# EAGLE design wizneteval (EAGLE 7.2.0)

## Sheet 1 of 2
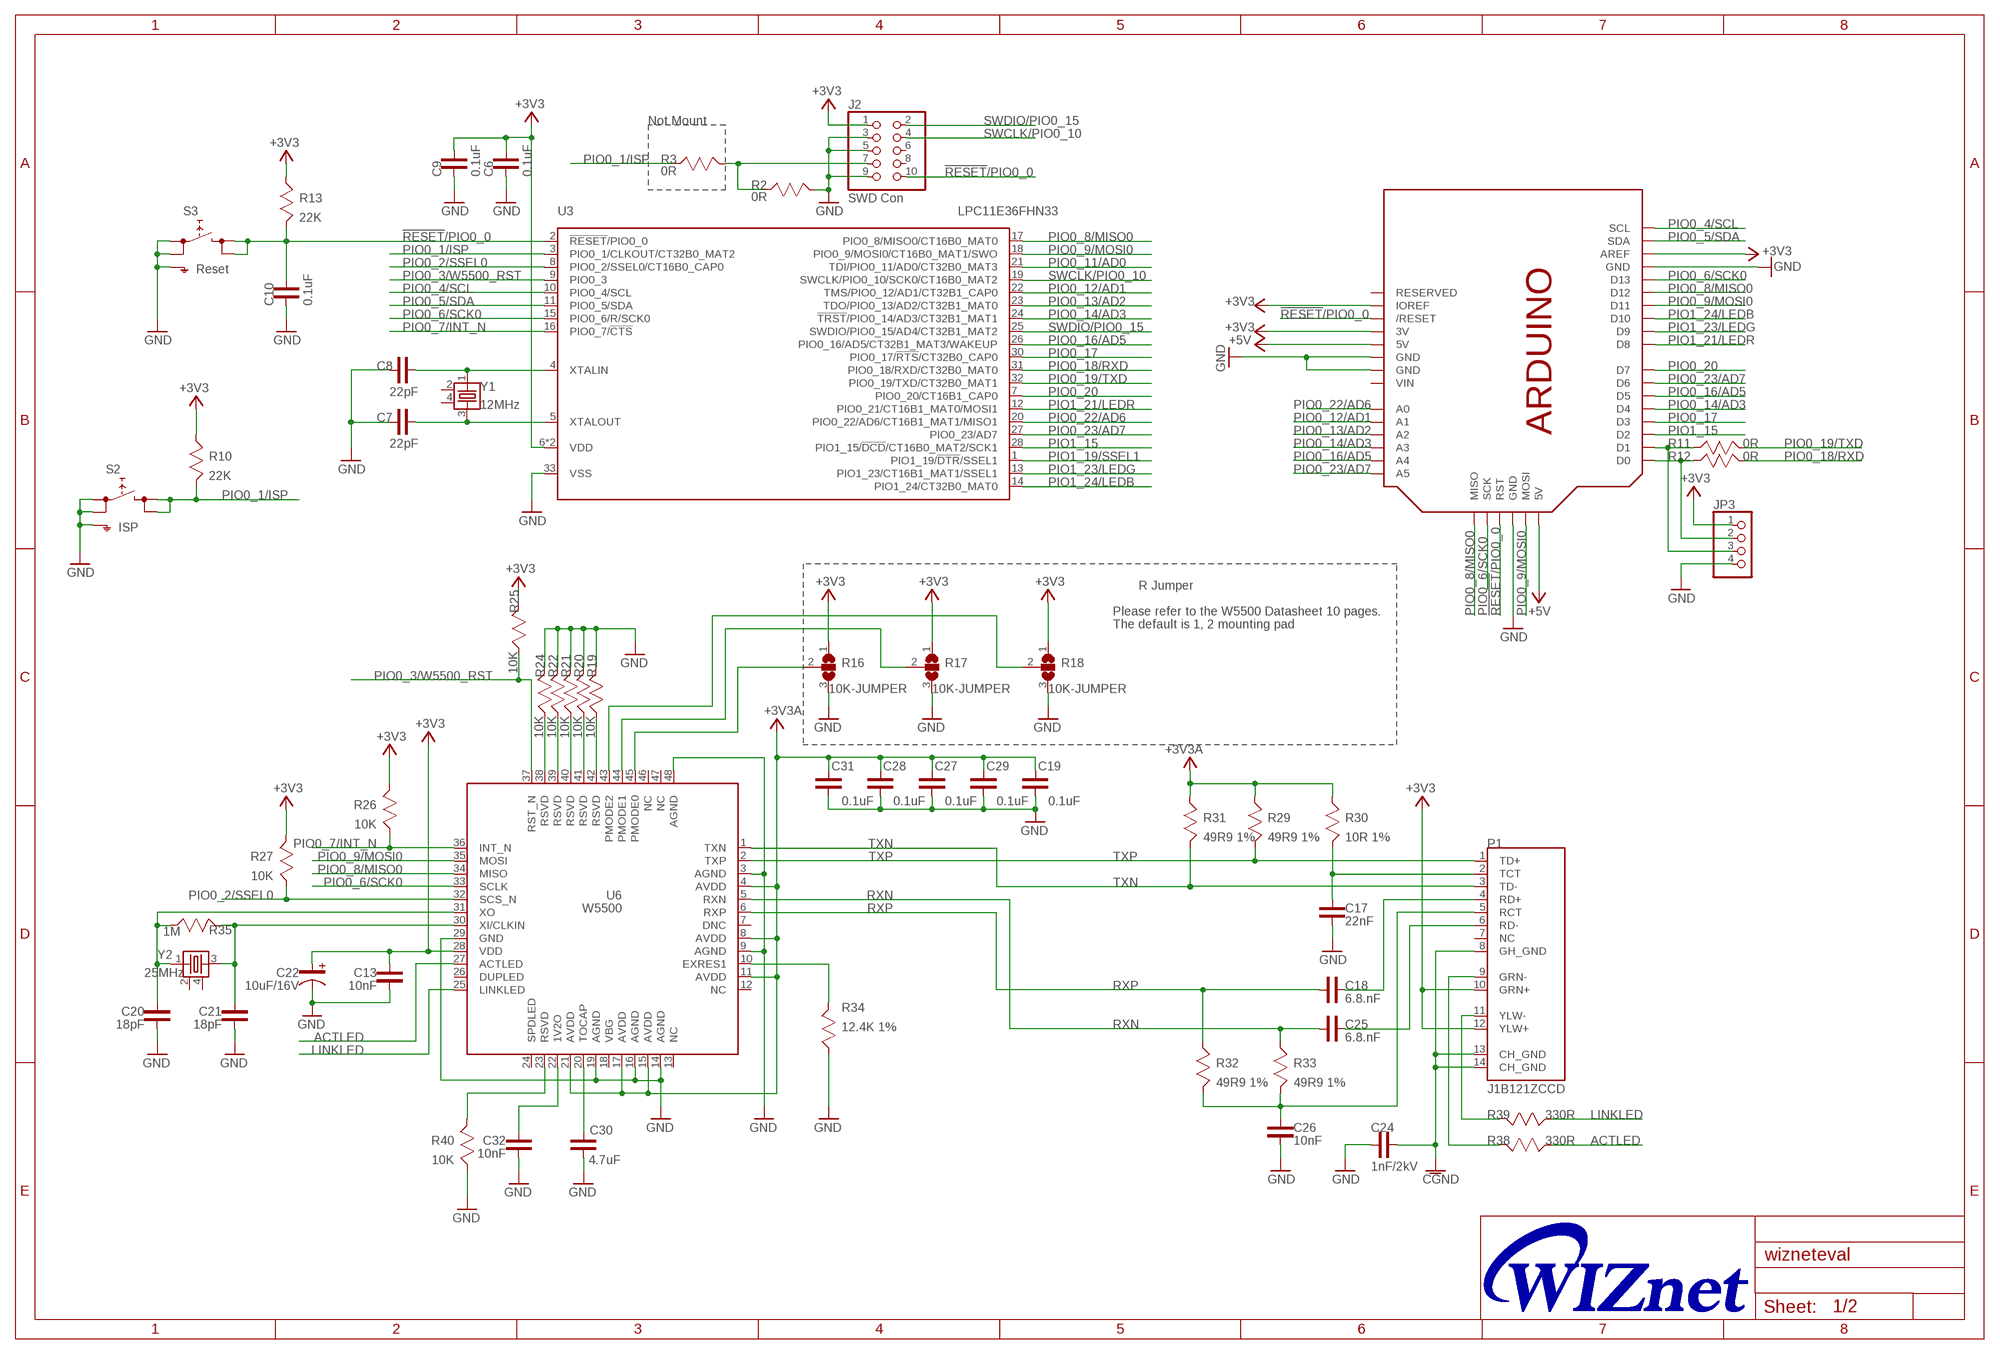
[diagram p0: schematic, sheet 1]

### Parts
$$U$3  ARDUINO_R3_ICSP  [ARDUINOR3_ICSP]
C6  0.1uF  C-1608  [C-1608]
C7  22pF  C-1608  [C-1608]
C8  22pF  C-1608  [C-1608]
C9  0.1uF  C-1608  [C-1608]
C10  0.1uF  C-1608  [C-1608]
C13  10nF  C-1608  [C-1608]
C17  22nF  C-1608  [C-1608]
C18  6.8.nF  C-1608  [C-1608]
C19  0.1uF  C-1608  [C-1608]
C20  18pF  C-1608  [C-1608]
C21  18pF  C-1608  [C-1608]
C22  10uF/16V  C-3216(TANTAL)  [C-3216(TANTAL)]
C24  1nF/2kV  C-4520  [C-4520]
C25  6.8.nF  C-1608  [C-1608]
C26  10nF  C-1608  [C-1608]
C27  0.1uF  C-1608  [C-1608]
C28  0.1uF  C-1608  [C-1608]
C29  0.1uF  C-1608  [C-1608]
C30  4.7uF  C-2012  [C-2012]
C31  0.1uF  C-1608  [C-1608]
C32  10nF  C-1608  [C-1608]
J2  SWD Con  2X5_1.27  [2X5_1.27]
JP3  PINHD-1X4  [1X04]
P1  J1B121ZCCD  [J1B121ZCCD]
R2  0R  R-1608  [R-1608]
R3  0R  R-1608  [R-1608]
R10  22K  R-1608  [R-1608]
R11  0R  R-1608  [R-1608]
R12  0R  R-1608  [R-1608]
R13  22K  R-1608  [R-1608]
R16  10K-JUMPER  R-1608-JUMPER  [R-1608-JUMPER]
R17  10K-JUMPER  R-1608-JUMPER  [R-1608-JUMPER]
R18  10K-JUMPER  R-1608-JUMPER  [R-1608-JUMPER]
R19  10K  R-1608  [R-1608]
R20  10K  R-1608  [R-1608]
R21  10K  R-1608  [R-1608]
R22  10K  R-1608  [R-1608]
R24  10K  R-1608  [R-1608]
R25  10K  R-1608  [R-1608]
R26  10K  R-1608  [R-1608]
R27  10K  R-1608  [R-1608]
R29  49R9 1%  R-1608  [R-1608]
R30  10R 1%  R-1608  [R-1608]
R31  49R9 1%  R-1608  [R-1608]
R32  49R9 1%  R-1608  [R-1608]
R33  49R9 1%  R-1608  [R-1608]
R34  12.4K 1%  R-1608  [R-1608]
R35  1M  R-1608  [R-1608]
R38  330R  R-1608  [R-1608]
R39  330R  R-1608  [R-1608]
R40  10K  R-1608  [R-1608]
S2  ISP  SKHMPSE010  [SKHMPXE010]
S3  Reset  SKHMPSE010  [SKHMPXE010]
U3  LPC11E36FHN33  [SOT-HVQFN33]
U6  W5500  [W5500]
Y1  12MHz  XTAL3225  [XTAL3225]
Y2  25MHz  XTAL3225  [XTAL3225]

### Nets
!RESET!/PIO0_0: $$U$3.RESET(/RESET) $$U$3.RESET_ICSP(RST) C10.2 J2.10 R13.1 S3.3(2.1) S3.4(2.2) U3.2(!RESET!/PIO0_0) ; also sheet 2
+3V3: $$U$3.3V $$U$3.AREF $$U$3.IOREF C6.2 C9.2 C13.2 C22.1 J2.1 JP3.1 P1.10(GRN+) P1.12(YLW+) R10.2 R13.2 R16.1 R17.1 R18.1 R25.2 R26.2 R27.2 U3.6(VDD) U3.29(VDD) U6.28(VDD) ; also sheet 2
+3V3A: C19.2 C27.2 C28.2 C29.2 C31.2 R29.2 R30.2 R31.2 U6.4(AVDD) U6.8(AVDD) U6.11(AVDD) U6.15(AVDD) U6.17(AVDD) U6.21(AVDD) ; also sheet 2
+5V: $$U$3.5V $$U$3.5V_ICSP(5V) ; also sheet 2
ACTLED: R38.2 U6.27(ACTLED)
GND: $$U$3.GND $$U$3.GND@1(GND) $$U$3.GND@2(GND) $$U$3.GND@3(GND) C6.1 C7.1 C8.1 C9.1 C10.1 C13.1 C17.1 C19.1 C20.1 C21.1 C22.2 C24.1 C26.1 C27.1 C28.1 C29.1 C30.P$1 C31.1 C32.1 J2.3 J2.5 J2.9 JP3.4 R2.1 R16.3 R17.3 R18.3 R19.2 R20.2 R21.2 R22.2 R24.2 R34.1 R40.1 S2.1(1.1) S2.2(1.2) S2.5(SH) S3.1(1.1) S3.2(1.2) S3.5(SH) U3.33(VSS) U6.3(AGND) U6.9(AGND) U6.14(AGND) U6.16(AGND) U6.19(AGND) U6.29(GND) U6.48(AGND) ; also sheet 2
GNDA: C24.2 P1.8(GH_GND) P1.13(CH_GND) P1.14(CH_GND) ; supply symbol labelled CGND
LINKLED: R39.2 U6.25(LINKLED)
N$1: C8.2 U3.4(XTALIN) Y1.1
N$2: C7.2 U3.5(XTALOUT) Y1.3
N$3: R34.2 U6.10(EXRES1)
N$4: C30.P$2 U6.20(TOCAP)
N$5: $$U$3.D1 JP3.3 R11.2
N$6: C32.2 U6.22(1V2O)
N$8: R40.2 U6.23(RSVD)
N$9: R19.1 U6.42(RSVD)
N$10: R20.1 U6.41(RSVD)
N$11: R21.1 U6.40(RSVD)
N$12: R22.1 U6.39(RSVD)
N$13: R24.1 U6.38(RSVD)
N$30: C18.1 P1.4(RD+)
N$31: C25.1 P1.6(RD-)
N$33: C17.2 P1.2(TCT) R30.1
N$34: P1.11(YLW-) R39.1
N$35: P1.9(GRN-) R38.1
N$36: C26.2 P1.5(RCT) R32.1 R33.1
N$37: $$U$3.D0 JP3.2 R12.2
N$57: J2.7 R2.2 R3.1
PIO0_1/ISP: R3.2 R10.1 S2.3(2.1) S2.4(2.2) U3.3(PIO0_1/CLKOUT/CT32B0_MAT2) ; also sheet 2
PIO0_2/SSEL0: R27.1 U3.8(PIO0_2/SSEL0/CT16B0_CAP0) U6.32(SCS_N) ; also sheet 2
PIO0_3/W5500_RST: R25.1 U3.9(PIO0_3) U6.37(RST_N) ; also sheet 2
PIO0_4/SCL: $$U$3.SCL U3.10(PIO0_4/SCL) ; also sheet 2
PIO0_5/SDA: $$U$3.SDA U3.11(PIO0_5/SDA) ; also sheet 2
PIO0_6/SCK0: $$U$3.D13 $$U$3.SCK U3.15(PIO0_6/R/SCK0) U6.33(SCLK) ; also sheet 2
PIO0_7/INT_N: R26.1 U3.16(PIO0_7/!CTS!) U6.36(INT_N) ; also sheet 2
PIO0_8/MISO0: $$U$3.D12 $$U$3.MISO U3.17(PIO0_8/MISO0/CT16B0_MAT0) U6.34(MISO) ; also sheet 2
PIO0_9/MOSI0: $$U$3.D11 $$U$3.MOSI U3.18(PIO0_9/MOSI0/CT16B0_MAT1/SWO) U6.35(MOSI) ; also sheet 2
PIO0_11/AD0: U3.21(TDI/PIO0_11/AD0/CT32B0_MAT3) ; also sheet 2
PIO0_12/AD1: $$U$3.A1 U3.22(TMS/PIO0_12/AD1/CT32B1_CAP0) ; also sheet 2
PIO0_13/AD2: $$U$3.A2 U3.23(TDO/PIO0_13/AD2/CT32B1_MAT0) ; also sheet 2
PIO0_14/AD3: $$U$3.A3 $$U$3.D4 U3.24(!TRST!/PIO0_14/AD3/CT32B1_MAT1) ; also sheet 2
PIO0_16/AD5: $$U$3.A4 $$U$3.D5 U3.26(PIO0_16/AD5/CT32B1_MAT3/WAKEUP) ; also sheet 2
PIO0_17: $$U$3.D3 U3.30(PIO0_17/!RTS!/CT32B0_CAP0) ; also sheet 2
PIO0_18/RXD: R12.1 U3.31(PIO0_18/RXD/CT32B0_MAT0) ; also sheet 2
PIO0_19/TXD: R11.1 U3.32(PIO0_19/TXD/CT32B0_MAT1) ; also sheet 2
PIO0_20: $$U$3.D7 U3.7(PIO0_20/CT16B1_CAP0) ; also sheet 2
PIO0_22/AD6: $$U$3.A0 U3.20(PIO0_22/AD6/CT16B1_MAT1/MISO1) ; also sheet 2
PIO0_23/AD7: $$U$3.A5 $$U$3.D6 U3.27(PIO0_23/AD7) ; also sheet 2
PIO1_15: $$U$3.D2 U3.28(PIO1_15/!DCD!/CT16B0_MAT2/SCK1) ; also sheet 2
PIO1_19/SSEL1: U3.1(PIO1_19/!DTR!/SSEL1) ; also sheet 2
PIO1_21/LEDR: $$U$3.D8 U3.12(PIO0_21/CT16B1_MAT0/MOSI1) ; also sheet 2
PIO1_23/LEDG: $$U$3.D9 U3.13(PIO1_23/CT16B1_MAT1/SSEL1) ; also sheet 2
PIO1_24/LEDB: $$U$3.D10 U3.14(PIO1_24/CT32B0_MAT0) ; also sheet 2
PMODE0: R16.2 U6.45(PMODE0)
PMODE1: R17.2 U6.44(PMODE1)
POMDE2: R18.2 U6.43(PMODE2)
RXN: C25.2 R33.2 U6.5(RXN)
RXP: C18.2 R32.2 U6.6(RXP)
SWCLK/PIO0_10: J2.4 U3.19(SWCLK/PIO0_10/SCK0/CT16B0_MAT2) ; also sheet 2
SWDIO/PIO0_15: J2.2 U3.25(SWDIO/PIO0_15/AD4/CT32B1_MAT2) ; also sheet 2
TXN: P1.3(TD-) R31.1 U6.1(TXN)
TXP: P1.1(TD+) R29.1 U6.2(TXP)
XI: C21.2 R35.2 U6.30(XI/CLKIN) Y2.3
XO: C20.2 R35.1 U6.31(XO) Y2.1
Unconnected: $$U$3.RESERVED J2.6 J2.8 P1.7(NC) U6.7(DNC) U6.12(NC) U6.13(NC) U6.18(VBG) U6.24(SPDLED) U6.26(DUPLED) U6.46(NC) U6.47(NC) Y1.2 Y1.4 Y2.2 Y2.4

### Notes on the sheet
- Not Mount
- R Jumper
- Please refer to the W5500 Datasheet 10 pages.
- The default is 1, 2 mounting pad

## Sheet 2 of 2
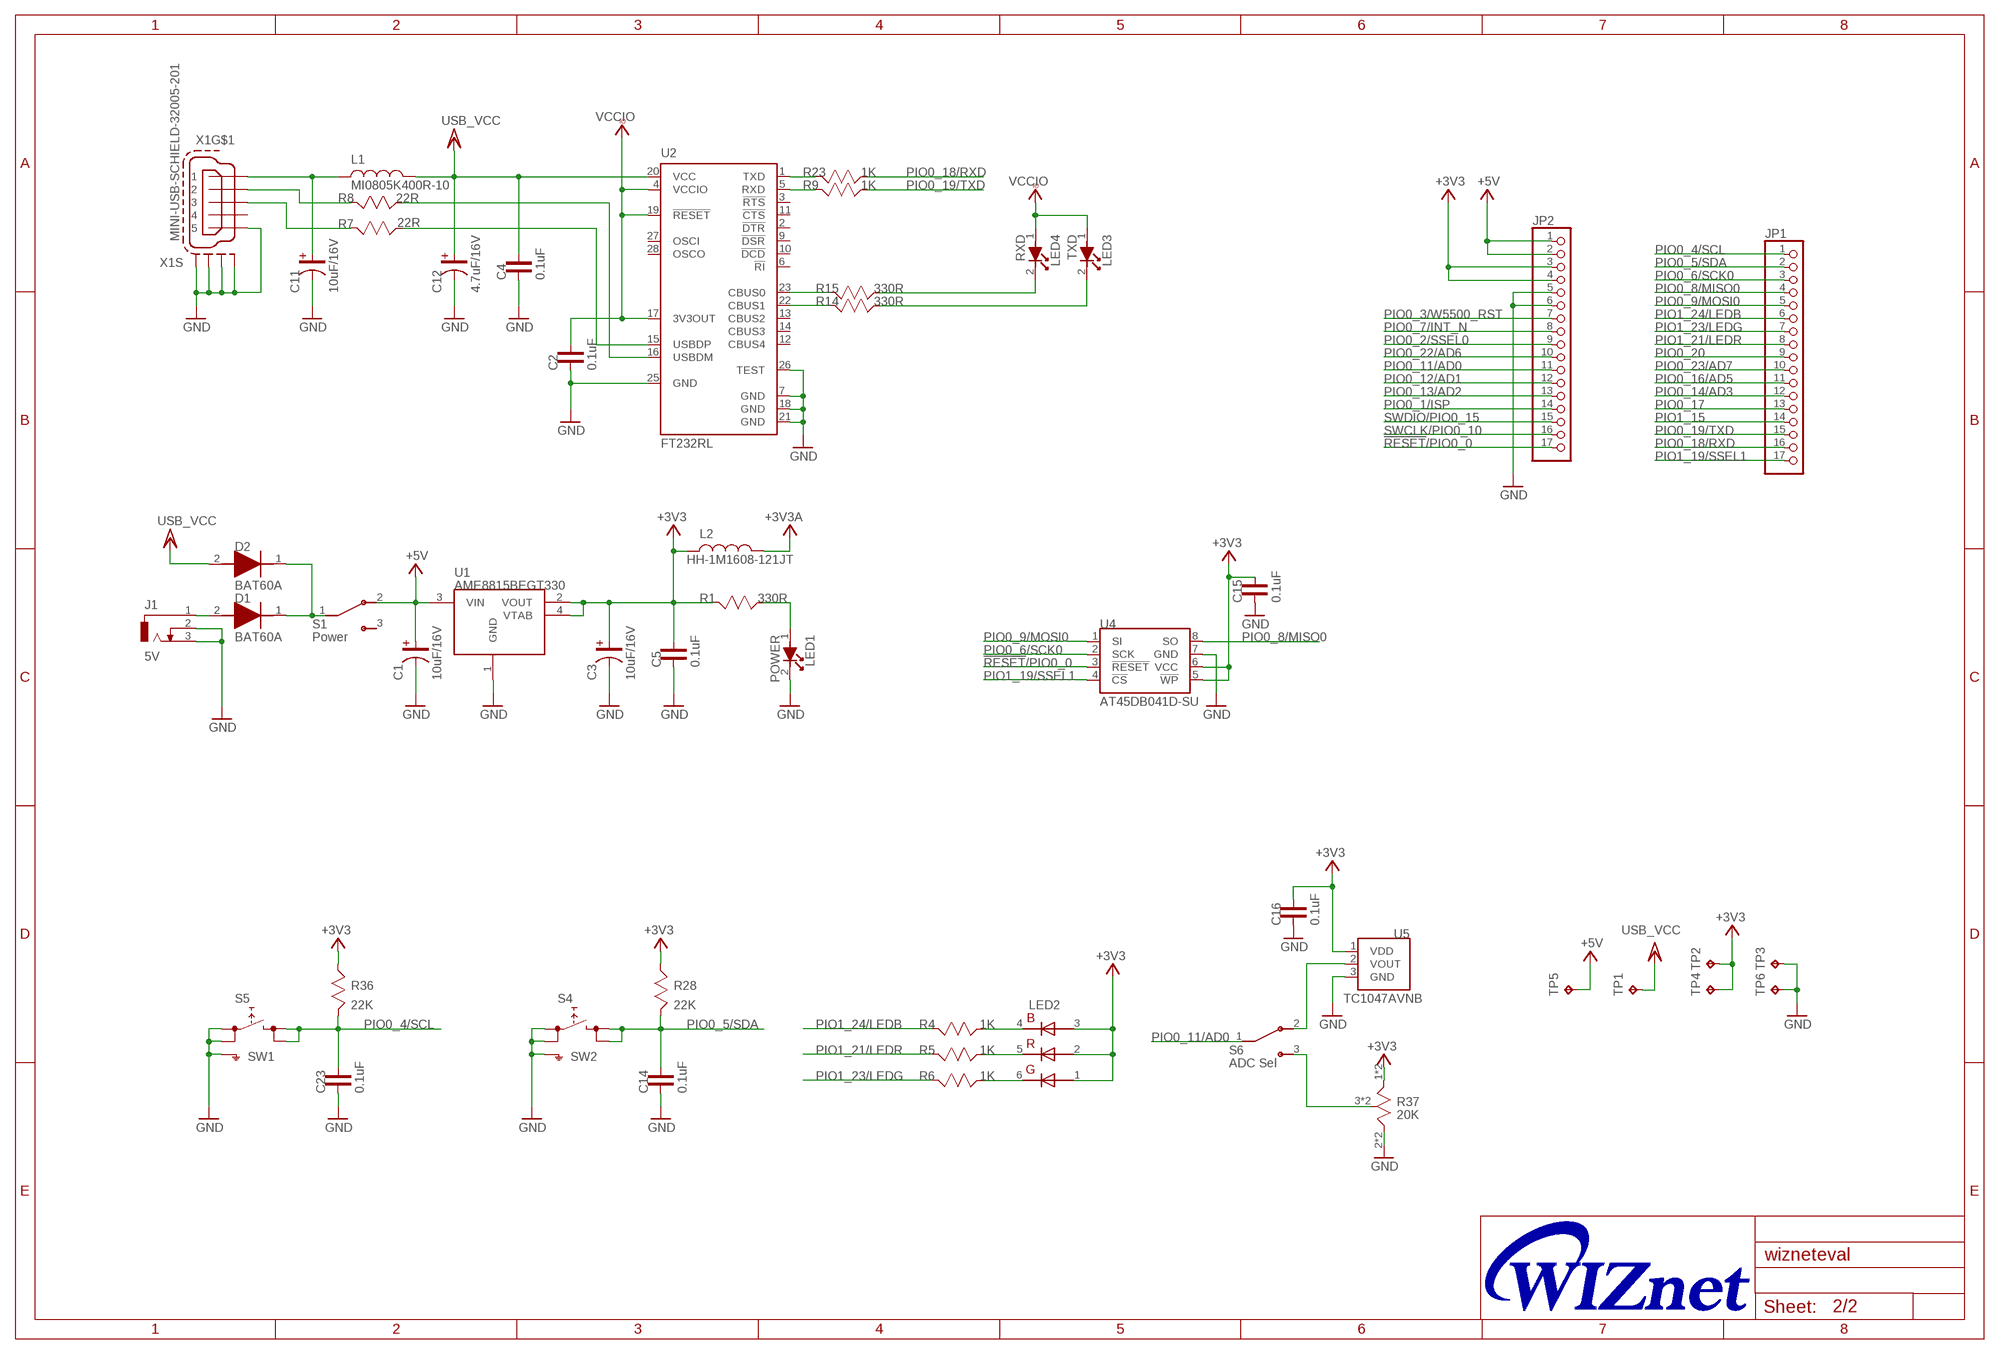
[diagram p1: schematic, sheet 2]

### Parts
C1  10uF/16V  C-3216(TANTAL)  [C-3216(TANTAL)]
C2  0.1uF  C-1608  [C-1608]
C3  10uF/16V  C-3216(TANTAL)  [C-3216(TANTAL)]
C4  0.1uF  C-1608  [C-1608]
C5  0.1uF  C-1608  [C-1608]
C11  10uF/16V  C-3216(TANTAL)  [C-3216(TANTAL)]
C12  4.7uF/16V  C-3216(TANTAL)  [C-3216(TANTAL)]
C14  0.1uF  C-1608  [C-1608]
C15  0.1uF  C-1608  [C-1608]
C16  0.1uF  C-1608  [C-1608]
C23  0.1uF  C-1608  [C-1608]
D1  BAT60A  [BAT60A]
D2  BAT60A  [BAT60A]
J1  5V  DCJ0202  [DCJ0202]
JP1  PINHD-1X17  [1X17]
JP2  PINHD-1X17  [1X17]
L1  MI0805K400R-10  L-2012  [L-2012]
L2  HH-1M1608-121JT  L-1608  [L-1608]
LED1  POWER  LED-1608  [LED-1608]
LED2  LS5050RGB5050  [LS5050RGB]
LED3  TXD  LED-1608  [LED-1608]
LED4  RXD  LED-1608  [LED-1608]
R1  330R  R-1608  [R-1608]
R4  1K  R-1608  [R-1608]
R5  1K  R-1608  [R-1608]
R6  1K  R-1608  [R-1608]
R7  22R  R-1608  [R-1608]
R8  22R  R-1608  [R-1608]
R9  1K  R-1608  [R-1608]
R14  330R  R-1608  [R-1608]
R15  330R  R-1608  [R-1608]
R23  1K  R-1608  [R-1608]
R28  22K  R-1608  [R-1608]
R36  22K  R-1608  [R-1608]
R37  20K  RES-VAR-PT10DAUL  [RES-VAR-PT10(DUAL)]
S1  Power  IMMS-12H  [IMMS-12H]
S4  SW2  SKHMPSE010  [SKHMPXE010]
S5  SW1  SKHMPSE010  [SKHMPXE010]
S6  ADC Sel  IMMS-12H  [IMMS-12H]
TP1  TPB1,27  [B1,27]
TP2  TPB1,27  [B1,27]
TP3  TPB1,27  [B1,27]
TP4  TPB1,27  [B1,27]
TP5  TPB1,27  [B1,27]
TP6  TPB1,27  [B1,27]
U1  AME8815BEGT330  [SOT-223]
U2  FT232RL  [SSOP28]
U4  AT45DB041D-SU  [8S2]
U5  TC1047AVNB  [SOT23]
X1  MINI-USB-SCHIELD-32005-201  [32005-201]

### Nets
!RESET!/PIO0_0: JP2.17 U4.3(!RESET) ; also sheet 1
+3V3: C3.1 C5.2 C15.2 C16.2 JP2.3 JP2.4 L2.1 LED2.1(GREEN_A) LED2.2(RED_A) LED2.3(BLUE_A) R1.1 R28.2 R36.2 R37.1 R37.P$1 TP2.TP TP4.TP U1.2(VOUT) U1.4(VTAB) U4.5(!WP) U4.6(VCC) U5.1(VDD) ; also sheet 1
+3V3A: L2.P$2 ; also sheet 1
+5V: C1.1 JP2.1 JP2.2 S1.2 TP5.TP U1.3(VIN) ; also sheet 1
GND: C1.2 C2.1 C3.2 C4.1 C5.1 C11.2 C12.2 C14.1 C15.1 C16.1 C23.1 J1.2 J1.3 JP2.5 JP2.6 LED1.2 R37.2 R37.P$3 S4.1(1.1) S4.2(1.2) S4.5(SH) S5.1(1.1) S5.2(1.2) S5.5(SH) TP3.TP TP6.TP U1.1(GND) U2.7(GND) U2.18(GND) U2.21(GND) U2.25(GND) U2.26(TEST) U4.7(GND) U5.3(GND) X1.5 X1.M1(S:S1) X1.M2(S:S2) X1.M3(S:S3) X1.M4(S:S4) ; also sheet 1
N$7: R23.1 U2.1(TXD)
N$14: S6.2 U5.2(VOUT)
N$15: R37.3 R37.P$2 S6.3
N$16: R9.1 U2.5(RXD)
N$17: LED2.4(BLUE_C) R4.2
N$18: LED2.5(RED_C) R5.2
N$19: LED2.6(GREEN_C) R6.2
N$20: C11.1 L1.1 X1.1
N$21: R8.1 X1.2
N$22: R8.2 U2.16(USBDM)
N$23: R7.1 X1.3
N$24: R7.2 U2.15(USBDP)
N$25: R15.1 U2.23(CBUS0)
N$26: R14.1 U2.22(CBUS1)
N$27: LED3.2 R14.2
N$28: LED4.2 R15.2
N$29: D1.2 J1.1
N$32: LED1.1 R1.2
N$39: D1.1 D2.1 S1.1
PIO0_1/ISP: JP2.14 ; also sheet 1
PIO0_2/SSEL0: JP2.9 ; also sheet 1
PIO0_3/W5500_RST: JP2.7 ; also sheet 1
PIO0_4/SCL: C23.2 JP1.1 R36.1 S5.3(2.1) S5.4(2.2) ; also sheet 1
PIO0_5/SDA: C14.2 JP1.2 R28.1 S4.3(2.1) S4.4(2.2) ; also sheet 1
PIO0_6/SCK0: JP1.3 U4.2(SCK) ; also sheet 1
PIO0_7/INT_N: JP2.8 ; also sheet 1
PIO0_8/MISO0: JP1.4 U4.8(SO) ; also sheet 1
PIO0_9/MOSI0: JP1.5 U4.1(SI) ; also sheet 1
PIO0_11/AD0: JP2.11 S6.1 ; also sheet 1
PIO0_12/AD1: JP2.12 ; also sheet 1
PIO0_13/AD2: JP2.13 ; also sheet 1
PIO0_14/AD3: JP1.12 ; also sheet 1
PIO0_16/AD5: JP1.11 ; also sheet 1
PIO0_17: JP1.13 ; also sheet 1
PIO0_18/RXD: JP1.16 R23.2 ; also sheet 1
PIO0_19/TXD: JP1.15 R9.2 ; also sheet 1
PIO0_20: JP1.9 ; also sheet 1
PIO0_22/AD6: JP2.10 ; also sheet 1
PIO0_23/AD7: JP1.10 ; also sheet 1
PIO1_15: JP1.14 ; also sheet 1
PIO1_19/SSEL1: JP1.17 U4.4(!CS) ; also sheet 1
PIO1_21/LEDR: JP1.8 R5.1 ; also sheet 1
PIO1_23/LEDG: JP1.7 R6.1 ; also sheet 1
PIO1_24/LEDB: JP1.6 R4.1 ; also sheet 1
SWCLK/PIO0_10: JP2.16 ; also sheet 1
SWDIO/PIO0_15: JP2.15 ; also sheet 1
VCC/2: C4.2 C12.1 D2.2 L1.2 TP1.TP U2.20(VCC) ; supply symbol labelled USB_VCC
VCCIO: C2.2 LED3.1 LED4.1 U2.4(VCCIO) U2.17(3V3OUT) U2.19(!RESET)
Unconnected: S1.3 U2.2(!DTR) U2.3(!RTS) U2.6(!RI) U2.9(!DSR) U2.10(!DCD) U2.11(!CTS) U2.12(CBUS4) U2.13(CBUS2) U2.14(CBUS3) U2.27(OSCI) U2.28(OSCO) X1.4

## Power pins joined to a net without a drawn wire
VIN: $$U$3.VIN

## Library data of the parts
$$U$3 = adafruit:ARDUINO_R3_ICSP
C1 C3 C11 C12 C22 = CAP:C-3216(TANTAL)
C2 C4-C10 C13-C21 C23 C25-C29 C31 C32 = CAP:C-1608
C24 = CAP:C-4520
C30 = CAP:C-2012
D1 D2 = DIODE:BAT60A
J1 = DC Jack:DCJ0202: DC POWER JACK Source: DCJ0202.pdf; OC_FARNELL: unknown; OC_NEWARK: unknown
J2 = PinHeader:2X5_1.27
JP1 JP2 = PinHeader:PINHD-1X17: PIN HEADER
JP3 = PinHeader:PINHD-1X4: PIN HEADER
L1 = INDUCTOR:L-2012
L2 = INDUCTOR:L-1608
LED1 LED3 LED4 = DIODE:LED-1608
LED2 = DIODE:LS5050RGB: For 5050 RGB LEDs, the order of the LEDs may vary from one manufacturer to another!
P1 = WIZnet:J1B121ZCCD
R1-R15 R19-R36 R38-R40 = RESISTOR:R-1608
R16-R18 = RESISTOR:R-1608-JUMPER
R37 = RESISTOR:RES-VAR-PT10
S1 S6 = switch:IMMS-12H
S2-S5 = switch:SKHMP*E010: 6.2 X 6.5mm TACT Switch (SMD) Source: http://www3.alps.co.jp/WebObjects/catalog.woa/PDF/E/Switch/Tact/SKHM/SKHM.PDF
TP1-TP6 = testpad:TP: Test pad
U1 = RECULATOR:AME8815BEGT330
U2 = ftdichip:FT232R: Source: http://www.ftdichip.com/Documents/DataSheets/DS_FT232R_v104.pdf; MPN: FT232RL; OC_FARNELL: 1146032; OC_NEWARK: 91K9918
U3 = nxp_60_1_1:LPC11E36FHN33: 32-bit ARM Cortex-M0 microcontroller; up to 128 kB flash; up to 12 kB SRAM and 4 kB EEPROM; USART The LPC11E3x are a ARM Cortex-M0 based, low-cost 32-bit MCU family, designed for 8/16-bit microcontroller applications, offering performance, low power, simple instruction set and memory addressing together with reduced code size compared to existing 8/16-bit architectures. The LPC11E3x operate at CPU frequencies of up to 50 MHz. The peripheral complement of the LPC11E3x includes up to 128 kB of flash memory, up to 12 kB of SRAM data memory and 4 kB EEPROM, one Fast-mode Plus I 2 C-bus interface, one RS-485/EIA-485 USART with support for synchronous mode and smart card interface, two SSP interfaces, four general purpose counter/timers, a 10-bit ADC, and up to 54 general purpose I/O pins. AAL Eindhoven MK
U4 = IC:AT45DB041D-SU
U5 = IC:TC1047AVNB
U6 = WIZnet:W5500
X1 = USB:MINI-USB-SCHIELD-: MINI USB-B Conector Source: www.cypressindustries.com; OC_FARNELL: unknown; OC_NEWARK: unknown
Y1 Y2 = X-TAL:XTAL3225

## Board
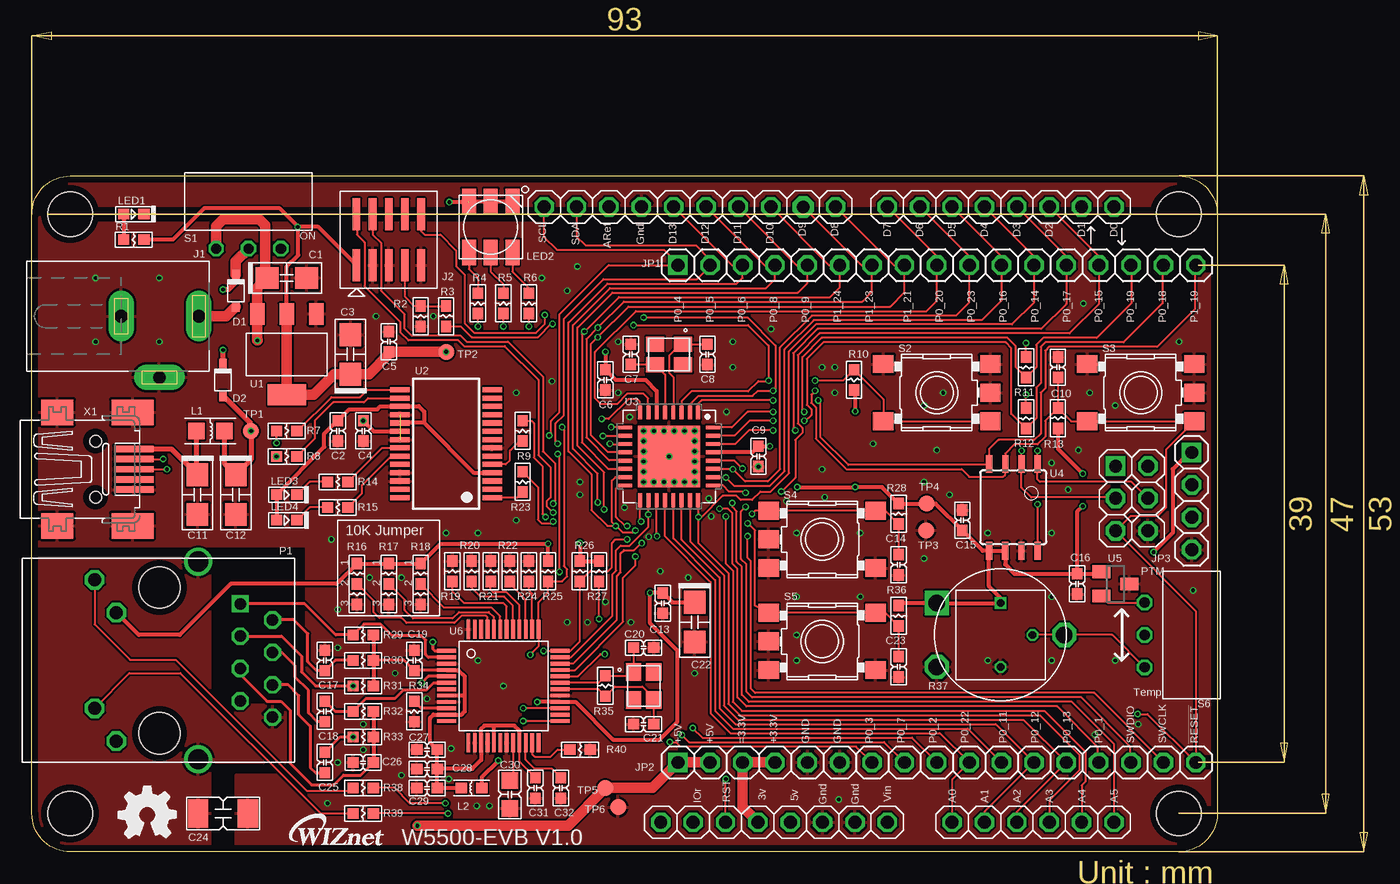
[diagram p2: board, top side]
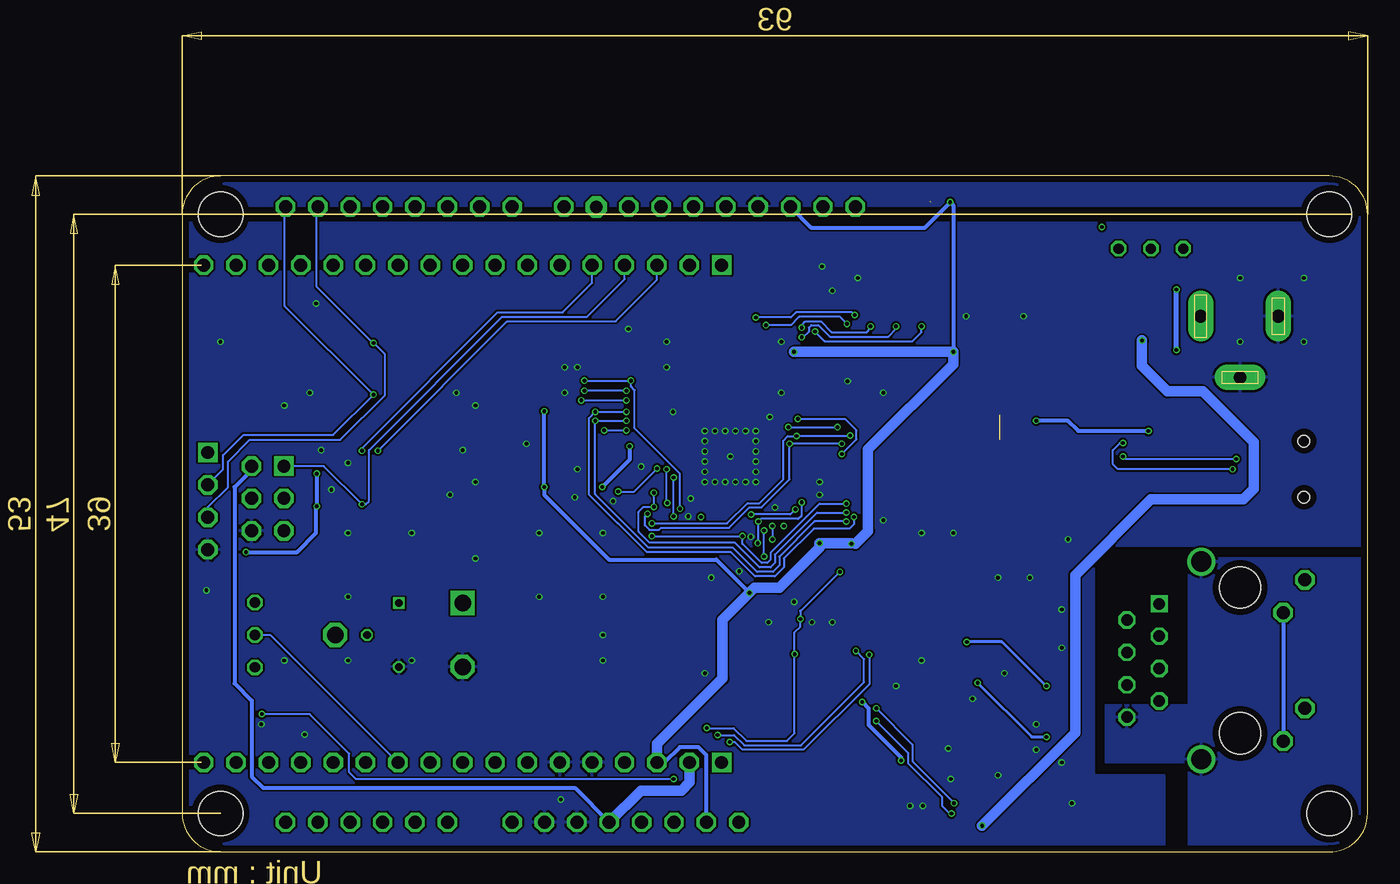
[diagram p3: board, bottom side, seen from below]

Size 93 x 53 mm. Coordinates in mm from the lower left corner, seen from the top.
Outline: 3,0 arc-90 0,3 0,50 arc-90 3,53 90,53 arc-90 93,50 93,3 arc-90 90,0 3,0
Copper layers (1*16): Top 0.035mm / dielectric 1.5mm / Bottom 0.035mm
Design rules "SK *": minimum track width 0.1mm, minimum drill 0.1mm, track to track 0.15mm, track to pad 0.2mm, pad to pad 0.15mm, via to via 0.15mm, smd to smd 0.15mm, copper to edge 20mil, drill to drill 0.3mm, minimum pad ring 0.1mm, minimum via ring 0.1mm, stop-mask expansion 1mil, vias tented up to drill 40mil, thermal gap 0.2mm
Holes 3.5 mm at 3,50 90,50 90,3 3,3

### Footprints (pad centres in the part's own frame; a part is rotated, then mirrored left to right if it is on the bottom)
ARDUINOR3_ICSP = drill 1.016 octagon: 3V 35.56,2.54; 5V 38.1,2.54; 5V_ICSP 66.167,30.48; A0 50.8,2.54; A1 53.34,2.54; A2 55.88,2.54; A3 58.42,2.54; A4 60.96,2.54; A5 63.5,2.54; AREF 23.876,50.8; D0 63.5,50.8; D1 60.96,50.8; D2 58.42,50.8; D3 55.88,50.8; D4 53.34,50.8; D5 50.8,50.8; D6 48.26,50.8; D7 45.72,50.8; D8 41.656,50.8; D10 36.576,50.8; D11 34.036,50.8; D12 31.496,50.8; D13 28.956,50.8; GND 26.416,50.8; GND@1 43.18,2.54; GND@2 40.64,2.54; GND@3 66.167,25.4; IOREF 30.48,2.54; MOSI 66.167,27.94; RESERVED 27.94,2.54; RESET 33.02,2.54; RESET_ICSP 63.627,25.4; SCK 63.627,27.94; SCL 18.796,50.8; SDA 21.336,50.8; VIN 45.72,2.54 | drill 1 pad 1.676 octagon: D9 39.116,50.8 | drill 1.016 square: MISO 63.627,30.48
C-3216(TANTAL) = smd 1.8 x 1.7: 1 1.55,0; 2 -1.55,0
C-1608 = smd 0.89 x 0.82: 1 0.8,0; 2 -0.8,0
C-4520 = smd 1.6 x 2.2: 1 -1.95,0; 2 1.95,0
C-2012 = smd 1.3 x 1.3: P$1 -1.1,0; P$2 1.1,0
BAT60A = smd 0.8 x 0.6: 1 1.25,0; 2 -1.25,0
DCJ0202 = drill 1 pad 2 long: 1 0,3.1; 2 4.8,0; 3 0,-3
2X5_1.27 = smd 2.5 x 0.6: 1 -2,2.54; 2 2,2.54; 3 -2,1.27; 4 2,1.27; 5 -2,0; 6 2,0; 7 -2,-1.27; 8 2,-1.27; 9 -2,-2.54; 10 2,-2.54
1X17 = drill 1.016 square: 1 -20.32,0 | drill 1.016 octagon: 2 -17.78,0; 3 -15.24,0; 4 -12.7,0; 5 -10.16,0; 6 -7.62,0; 7 -5.08,0; 8 -2.54,0; 9 0,0; 10 2.54,0; 11 5.08,0; 12 7.62,0; 13 10.16,0; 14 12.7,0; 15 15.24,0; 16 17.78,0; 17 20.32,0
1X04 = drill 1.016 square: 1 -3.81,0 | drill 1.016 octagon: 2 -1.27,0; 3 1.27,0; 4 3.81,0
L-2012 = smd 1.3 x 1.3: 1 -1.1,0; 2 1.1,0
L-1608 = smd 0.89 x 0.82: 1 -0.8,0; P$2 0.8,0
LED-1608 = smd 0.89 x 0.82: 1 -0.8,0; 2 0.8,0
LS5050RGB = smd 2 x 1.1: 1 2,-1.7; 2 2,0; 3 2,1.7; 4 -2,1.7; 5 -2,0; 6 -2,-1.7
J1B121ZCCD = drill 0.9 square: 1 -4.445,6.35 | drill 0.9 octagon: 2 -3.175,8.89; 3 -1.905,6.35; 4 -0.635,8.89; 5 0.635,6.35; 6 1.905,8.89; 7 3.175,6.35; 8 4.445,8.89 | drill 1.02 octagon: 9 -6.325,-5.08; 10 -3.758,-3.38; 11 3.758,-5.08; 12 6.325,-3.38 | drill 1.6: 13 -7.75,3.05; 14 7.75,3.05 | hole 3.25: -5.715,0; 5.715,0
R-1608 = smd 0.89 x 0.82: 1 -0.8,0; 2 0.8,0
R-1608-JUMPER = smd 0.89 x 0.82: 1 -1.6,0; 2 0,0; 3 1.6,0
RES-VAR-PT10(DUAL) = drill 1.3 square: 1 -2.5,-5 | drill 1.3 octagon: 2 2.5,-5; 3 0,5 | drill 0.6 square: P$1 -2.5,0 | drill 0.6 octagon: P$2 0,2.5; P$3 2.5,0
IMMS-12H = drill 0.8 octagon: 1 0,-3.7; 2 -2.54,-3.7; 3 2.54,-3.7
SKHMPXE010 = smd 1.6 x 1.4: 1 -4.2,2.25; 2 4.2,2.25; 3 -4.2,-2.25; 4 4.2,-2.25; 5 4.2,0
B1,27 = smd 1.27 x 1.27: TP 0,0
SOT-223 = smd 1.143 x 1.651: 1 -2.311,-3.175; 2 0,-3.175; 3 2.311,-3.175 | smd 3 x 1.651: 4 0,3.175
SSOP28 = smd 0.4 x 1.5: 1 -4.225,-3.625; 2 -3.575,-3.625; 3 -2.925,-3.625; 4 -2.275,-3.625; 5 -1.625,-3.625; 6 -0.975,-3.625; 7 -0.325,-3.625; 8 0.325,-3.625; 9 0.975,-3.625; 10 1.625,-3.625; 11 2.275,-3.625; 12 2.925,-3.625; 13 3.575,-3.625; 14 4.225,-3.625; 15 4.225,3.625; 16 3.575,3.625; 17 2.925,3.625; 18 2.275,3.625; 19 1.625,3.625; 20 0.975,3.625; 21 0.325,3.625; 22 -0.325,3.625; 23 -0.975,3.625; 24 -1.625,3.625; 25 -2.275,3.625; 26 -2.925,3.625; 27 -3.575,3.625; 28 -4.225,3.625
SOT-HVQFN33 = smd 1.075 x 0.3: 1 -3.438,2.275; 2 -3.438,1.625; 3 -3.438,0.975; 4 -3.438,0.325; 5 -3.438,-0.325; 6 -3.438,-0.975; 7 -3.438,-1.625; 8 -3.438,-2.275; 17 3.438,-2.275; 18 3.438,-1.625; 19 3.438,-0.975; 20 3.438,-0.325; 21 3.438,0.325; 22 3.438,0.975; 23 3.438,1.625; 24 3.438,2.275 | smd 0.3 x 1.075: 9 -2.275,-3.438; 10 -1.625,-3.438; 11 -0.975,-3.438; 12 -0.325,-3.438; 13 0.325,-3.438; 14 0.975,-3.438; 15 1.625,-3.438; 16 2.275,-3.438; 25 2.275,3.438; 26 1.625,3.438; 27 0.975,3.438; 28 0.325,3.438; 29 -0.325,3.438; 30 -0.975,3.438; 31 -1.625,3.438; 32 -2.275,3.438 | smd 4.85 x 4.85: 33 0,0
8S2 = smd 0.5 x 1.4: 1 -1.905,-3.404; 2 -0.645,-3.404; 3 0.625,-3.404; 4 1.895,-3.404; 5 1.905,3.404; 6 0.635,3.404; 7 -0.635,3.404; 8 -1.905,3.404
SOT23 = smd 1 x 1.4: 1 -0.95,-1.1; 2 0.95,-1.1; 3 0,1.1
W5500 = smd 1.5 x 0.3: 1 -4.45,2.75; 2 -4.45,2.25; 3 -4.45,1.75; 4 -4.45,1.25; 5 -4.45,0.75; 6 -4.45,0.25; 7 -4.45,-0.25; 8 -4.45,-0.75; 9 -4.45,-1.25; 10 -4.45,-1.75; 11 -4.45,-2.25; 12 -4.45,-2.75; 25 4.45,-2.75; 26 4.45,-2.25; 27 4.45,-1.75; 28 4.45,-1.25; 29 4.45,-0.75; 30 4.45,-0.25; 31 4.45,0.25; 32 4.45,0.75; 33 4.45,1.25; 34 4.45,1.75; 35 4.45,2.25; 36 4.45,2.75 | smd 0.3 x 1.5: 13 -2.75,-4.45; 14 -2.25,-4.45; 15 -1.75,-4.45; 16 -1.25,-4.45; 17 -0.75,-4.45; 18 -0.25,-4.45; 19 0.25,-4.45; 20 0.75,-4.45; 21 1.25,-4.45; 22 1.75,-4.45; 23 2.25,-4.45; 24 2.75,-4.45; 37 2.75,4.45; 38 2.25,4.45; 39 1.75,4.45; 40 1.25,4.45; 41 0.75,4.45; 42 0.25,4.45; 43 -0.25,4.45; 44 -0.75,4.45; 45 -1.25,4.45; 46 -1.75,4.45; 47 -2.25,4.45; 48 -2.75,4.45
32005-201 = smd 3.1 x 0.5: 1 3,1.6; 2 3,0.8; 3 3,0; 4 3,-0.8; 5 3,-1.6 | smd 2.5 x 2: M1 -3,-4.45; M2 -3,4.45 | smd 3.3 x 2: M3 2.9,4.45; M4 2.9,-4.45 | hole 0.9: 0,2.2; 0,-2.2
XTAL3225 = smd 1.4 x 1.2: 1 -1.1,-0.8; 2 1.1,-0.8; 3 1.1,0.8; 4 -1.1,0.8

### Placement (x,y rotation side)
$$U$2  [WIZNET3-LOGO]  20,0.5 0 top
$$U$3  21.4,-0.23 0 top
C1  20,45 180 top
C2  24,33 270 top
C3  25,39 270 top
C4  26,33 270 top
C5  28,40 90 top
C6  45,37 270 top
C7  47,39 90 top
C8  53,39 270 top
C9  57,31 270 top
C10  80.5,38 90 top
C11  13,28 90 top
C12  16,28 90 top
C13  49.5,19.5 270 top
C14  68,22.5 270 top
C15  73,26 90 top
C16  82,21 270 top
C17  23,15 90 top
C18  23,11 270 top
C19  30,15 90 top
C20  48,16 0 top
C21  48,10 180 top
C22  52,18 90 top
C23  68,14.5 270 top
C24  15,3 180 top
C25  23,7 270 top
C26  26,7 180 top
C27  31,8 180 top
C28  31,6.5 180 top
C29  31,5 180 top
C30  37.5,4.5 90 top
C31  39.5,5 270 top
C32  41.5,5 270 top
D1  16,44 90 top
D2  15,37 90 top
J1  10,42 270 top
J2  28,48 90 top
JP1  71,46 0 top
JP2  71,7 0 top
JP3  91,27.5 270 top
L1  14,33 0 top
L2  34.5,5 180 top
LED1  8,50 0 top
LED2  36,49 90 top
LED3  20,28 0 top
LED4  20,26 0 top
P1  10,15 270 top
R1  8,48 180 top
R2  30.5,42 90 top
R3  32.5,42 270 top
R4  35,43 90 top
R5  37,43 90 top
R6  39,43 90 top
R7  20,33 0 top
R8  20,31 0 top
R9  38.5,33 90 top
R10  64.5,37 270 top
R11  78,38 90 top
R12  78,34 90 top
R13  80.5,34 270 top
R14  24,29 180 top
R15  24,27 180 top
R16  25.5,21 270 top
R17  28,21 270 top
R18  30.5,21 270 top
R19  33,22 90 top
R20  34.5,22 90 top
R21  36,22 90 top
R22  37.5,22 90 top
R23  38.5,29 90 top
R24  39,22 90 top
R25  40.5,22 90 top
R26  43,22 90 top
R27  44.5,22 90 top
R28  68,26.5 90 top
R29  26,17 0 top
R30  26,15 0 top
R31  26,13 0 top
R32  26,11 180 top
R33  26,9 180 top
R34  30,11 90 top
R35  45,13 270 top
R36  68,18.5 90 top
R37  76,17 270 top
R38  26,5 0 top
R39  26,3 0 top
R40  43,8 180 top
S1  17,51 0 top
S2  71,36 0 top
S3  87,36 0 top
S4  62,24.5 180 top
S5  62,16.5 180 top
S6  91,17 270 top
TP1  17.2,33 0 top
TP2  32.5,39.2 0 top
TP3  70.15,25.2 0 top
TP4  70.2,27.3 0 top
TP5  45,5 0 top
TP6  46,3.5 0 top
U1  20,39 180 top
U2  32.5,32 90 top
U3  50,31 270 top
U4  77,27 180 top
U5  85,21 270 top
U6  37,13 0 top
U$1  [OSHP-LOGO]  6,0.5 0 top
X1  5,30 0 top
Y1  50,39 180 top
Y2  48,13 270 top

### Tracks (layer width: path | path; a pad name or v marks a point on that pad's centre or on a via)
!RESET!/PIO0_0  (via drill 0.3)
  Top 0.15: U3.2 51.65,34.46 51.65,35.1 52.3,35.75 56.55,35.75 56.95,36.15 v58.15,36.15 58.35,36.35 58.35,39.7 56.15,41.9 v48,41.9 | v61.45,36.15 61.15,35.85 61.15,35.2 61.5,34.85 61.5,32.4 63.9,30 72.95,30 73.55,29.4 76.2,29.4 76.38,29.57 U4.3 76.38,31.23 77.1,31.95 78.9,31.95 79.5,32.55 79.5,33.8 R13.1 | C10.2 R13.1 | R13.1 81.55,33.75 S3.3 S3.4 89,31.55 89,27 88.35,26.35 86.21,26.35 $$U$3.RESET_ICSP 91.32,18.88 JP2.17 87.52,10.8 v86.75,10.8 | J2.10 30.55,48.65 30.8,48.4 32.05,48.4 33.3,47.15 33.3,45.9 33.95,45.25 33.95,41.45 34.7,40.7 39.55,40.7 40.25,41.4 v40.25,42.1 | $$U$3.RESET 54.42,5.67 v54.45,5.7
  Bottom 0.15: v58.15,36.15 v61.45,36.15 | v40.25,42.1 40.45,42.3 44.85,42.3 45.25,41.9 v48,41.9 | v54.45,5.7 79.35,5.7 79.9,6.25 79.9,7.7 83,10.8 v86.75,10.8
+3V3  (via drill 0.3)  (1 unrouted)
  Top 0.3: U3.6 49.02,36.12 48.15,37 45.8,37 C6.2 v45,39.2 | U3.29 56.52,31.32 C9.2 v57.9,31.8 | v43,24.2 R26.2 R27.2 | R25.2 v40.5,24.15 32.05,24.15 R18.1 R17.1 R16.1 23.9,21 15.6,21 11.6,17 8.4,17 6.64,18.76 P1.10 | v39.65,11.75 U6.28 42.65,11.75 45.6,8.8 49.25,8.8 50.65,10.2 50.65,15.75 48.5,17.9 v48.5,20.3 C13.2 50.25,19.55 C22.1 | 35.3,5.45 L2.1 35.3,5.85 v36.6,7.15 | U1.2 20,45.9 20.9,46.8 20.9,49 | 20.9,49 19.45,50.45 13.5,50.45 11.05,48 R1.1 | 34.25,50.95 v32.75,50.95 | J2.1 22.46,49 v20.85,49 20.9,49 | v60.05,28.6 v64.6,28.6 66.7,28.6 R28.2 TP4.TP 70.9,27.3 C15.2 74.6,23.6 U4.5 | v64.6,34.55 64.6,36.1 R10.2 | U4.5 U4.6 76.36,22.54 77.1,21.8 C16.2 | U4.5 75.09,20.8 76,19.9 R37.P$1 R37.1 68.2,19.5 R36.2 | C16.2 83.75,21.8 U5.1 | R13.2 80.5,31.6 v82.45,29.65 | v82.45,27.1 82,26.65 C16.2 | JP3.1 90.81,31.31 89.5,30 89.5,25 v88,23.5 | LED2.3 LED2.2 LED2.1
  Top 0.813: U1.2 U1.4 20.02,35.85 22.1,35.85 23.7,37.45 C3.1 26.45,37.45 28,39 C5.2 TP2.TP | JP2.4 JP2.3 55.76,3.51 $$U$3.3V
  Bottom 0.3: 40.55,24.2 v40.5,24.15 40.2,24.15 | 43.2,24.2 v43,24.2 | v39.65,11.75 39.15,11.25 39.15,9.95 36.6,7.4 v36.6,7.15 | TP2.TP 32.5,50.7 v32.75,50.95 34.75,48.95 43.66,48.95 $$U$3.AREF | $$U$3.IOREF 51.88,7.58 52.5,8.2 53.95,8.2 55.15,7 JP2.3 | v57.9,31.8 57.9,30.75 v60.05,28.6 | v64.6,34.55 v64.6,28.6 64.6,28 59.5,22.9 51.1,22.9 v48.5,20.3 | v82.45,29.65 v82.45,27.1 82.5,27.05 82.5,25 84,23.5 v88,23.5
  Bottom 0.305: P1.10 P1.12
  Bottom 0.813: 40.55,24.2 v43,24.2 43,23.85 46.15,20.7 48.1,20.7 v48.5,20.3 50.6,18.2 50.6,13.6 55.75,8.45 JP2.3 | 40.2,24.15 39.2,25.15 39.2,31.55 32.5,38.25 TP2.TP v45,39.2
  other vias: 32.5,39.2
+3V3A
  Top 0.15: C31.2 38.25,7.05 U6.21
  Top 0.254: U6.4 30.05,14.25 C19.2 29.2,15 R30.2
  Top 0.3: U6.4 33.45,14.25 33.95,13.75 33.95,12.25 | 33.95,12.25 33.95,11 33.7,10.75 U6.11 31.5,10.75 31.25,10.5 31.25,8.55 C27.2 C28.2 | L2.P$2 C29.2 C28.2 | C28.2 34.55,6.5 35.25,7.2 U6.15 35.25,9.65 35.5,9.9 36.25,9.9 | 33.95,12.25 U6.8 | U6.21 38.25,9.5 37.85,9.9 36.25,9.9 | U6.17 36.25,9.9
  Top 0.305: R29.2 R30.2 R31.2
+5V  (via drill 0.3)
  Top 0.813: S1.2 14.46,49.06 15,49.6 17.85,49.6 18.3,49.15 18.3,45.15 C1.1 17.69,44.24 U1.3 v17.69,40.11 v17.7,40.1 | JP2.2 JP2.1 48.68,5 TP5.TP 42.05,2.05 v30.25,2.05
  Bottom 0.3: $$U$3.5V 62.2,5 86.65,5 87.55,5.9 87.55,11.85 88.9,13.2 88.9,28.6 87.57,29.93 $$U$3.5V_ICSP
  Bottom 0.813: v30.25,2.05 22.95,9.35 22.95,21.7 17,27.65 9.75,27.65 8.95,28.45 8.95,32.1 12.95,36.1 15.7,36.1 17.7,38.1 v17.7,40.1 | JP2.2 53.22,5.43 53.85,4.8 57.01,4.8 $$U$3.5V
ACTLED  (via drill 0.3)
  Top 0.15: U6.27 v38.55,11.25 | 27,5 R38.2 28.45,5 29.65,3.8 v32.45,3.8
  Bottom 0.15: v38.55,11.25 35.7,8.4 35.7,7.1 32.45,3.85 v32.45,3.8
GND  (via drill 0.3)  (1 unrouted)
  other vias: 37,13 63.3,4.1 24,16 24,19 26.5,21.5 29,21.5 31,12 24,7 26,8 26,10 29,6 47,18 42,18 52,14 60,17 60,25 46,36 46,40 55,40 27,42 31.5,42 71.5,36 72,28 83,36 57,30.2 49.6,29 48,29 48.8,29 50.4,29 51.2,29 52,29 48,29.8 48,30.6 48,31.4 48,32.2 48,33 48.8,33 49.6,33 50.4,33 51.2,33 52,33 52,32.2 52,31.4 52,30.6 52,29.8 42.8,45.9 59.2,27.5 50,31 34.9,3.6 32.7,5.7 40.8,36.9 23.2,3.8 48.4,24.7 85,15 80,15 75,15 80,20 60,15 60,20 35,15 65,20 80,25 75,25 65,25 35,25 32.5,25 23.5,24.5 70,35 85,35 90,40 91.1,20.5 10,40 5,40 5,45 10,45 40,45 55,38 58,41 62,38 63,38 63,36 62,30 43,29 43,28 38,26 38,36 42,44 51.5,21.5 66,32 71,31.5 70,29 70,23 54.5,34.5 46.5,27 49.3,22 45,19.6 43.6,18 28.5,14 53.3,26.3 53.1,27.7 46.9,34.1 80,30.5 83.4,9.2 86.8,10 62.2,27.8 82.1,31.5 81.3,28.4 82.5,43 35.9,3.6 32.9,8.1
  pour Top: 93,0 93,53 0,53 0,24 21.5,24 21.5,6 16,6 16,0
  pour Bottom: 16,-1 94,-1 94,54 -1,54 -1,24 21.5,24 21.5,6 16,6
GNDA
  pour Top: 0,0 14,0 14,7 20.5,7 20.5,11.5 14,11.5 14,23 0,23
  pour Bottom: -0.5,0 14,0 14,7 20.5,7 20.5,11.5 14,11.5 14,23 0,23 -0.5,22.5
LINKLED  (via drill 0.3)
  Top 0.15: 27,3 R39.2 v32.65,3 | U6.25 v38.55,10.25
  Bottom 0.15: v38.55,10.25 36.05,7.75 36.05,6.95 33.4,4.3 33.4,3.6 32.8,3 v32.65,3
N$1
  Top 0.15: C8.2 Y1.1 50.9,39.8 50,38.9 50,37.55 50.33,37.23 U3.4
N$2
  Top 0.15: U3.5 49.67,37.42 Y1.3 C7.2
N$3
  Top 0.254: U6.10 30.55,11.25 R34.2
N$4
  Top 0.15: U6.20 37.75,5.85 C30.P$2
N$5  (via drill 0.3)
  Top 0.15: R11.2 v78,39.9
  Bottom 0.15: $$U$3.D1 82.45,50.48 82.45,44.3 78.05,39.9 v78,39.9 77.1,39 77.1,35.8 80.6,32.3 87.7,32.3 89.4,30.6 89.4,28.6 91,27 JP3.3
N$6
  Top 0.15: C32.2 40.8,6.5 39.45,6.5 38.75,7.2 U6.22
N$7
  Top 0.15: R23.1 38.08,27.77 U2.1
N$8
  Top 0.15: U6.23 39.25,7.65 39.45,7.45 40.7,7.45 41.25,8 R40.2
N$9
  Top 0.15: U6.42 37.25,19.25 37,19.5 33.9,19.5 33,20.4 R19.1
N$10
  Top 0.15: U6.41 37.75,19.3 37.05,20 35.2,20 34.5,20.7 R20.1
N$11
  Top 0.15: U6.40 38.25,19.35 37.25,20.35 36.2,20.35 36,20.55 R21.1
N$12
  Top 0.15: U6.39 38.75,19.75 37.5,21 R22.1
N$13
  Top 0.15: U6.38 39.25,20.25 39,20.5 R24.1
N$14
  Top 0.15: U5.2 84.41,19.54 S6.2
N$15
  Top 0.15: S6.3 84.76,17 R37.3 R37.P$2
N$16
  Top 0.15: U2.5 37.17,30.38 37.5,30.7 37.5,31.45 38.25,32.2 R9.1
N$17
  Top 0.15: LED2.4 34.3,45.7 35,45 R4.2
N$18
  Top 0.15: LED2.5 36,45.5 37,44.5 R5.2
N$19
  Top 0.15: LED2.6 37.7,45.5 39,44.2 R6.2
N$20
  Top 0.406: X1.1 10.95,31.6 C11.1 12.9,29.65 L1.1
N$21  (via drill 0.3)
  Top 0.15: X1.2 v10.3,30.8
  Bottom 0.15: v10.3,30.8 19,30.8 R8.1
  other vias: 19.2,31
N$22
  Top 0.15: R8.2 22.2,32.4 22.2,33.8 23.65,35.25 26.05,35.25 26.38,35.58 U2.16
N$23  (via drill 0.3)
  Top 0.15: X1.3 v10.6,30 | v19.2,32.05 R7.1
  Bottom 0.15: v10.6,30 19.6,30 20,30.4 20,31.5 19.45,32.05 v19.2,32.05
N$24
  Top 0.15: R7.2 20.85,33 23.5,35.65 25.75,35.65 26.32,36.23 U2.15
N$25
  Top 0.15: R15.1 25.9,28.1 25.9,28.75 28.18,31.02 U2.23
N$26
  Top 0.15: R14.1 27.48,31.68 U2.22
N$27
  Top 0.15: R14.2 21.8,29 LED3.2
N$28
  Top 0.15: R15.2 21.8,27 LED4.2
N$29
  Top 0.813: J1.1 15.25,42 D1.2
N$30
  Top 0.254: C18.1 22.4,10.2 21.7,10.9 21.7,12.65 20.65,13.7 20.65,14.6 19.65,15.6 18.93,15.6 P1.4
N$31
  Top 0.254: C25.1 22.25,6.2 21.85,6.6 21.85,9.85 20.95,10.75 20.95,12.25 20.1,13.1 P1.6
N$32
  Top 0.305: LED1.1 R1.2
N$33
  Top 0.254: R30.1 23.8,15 C17.2 22.35,14.2 21.65,14.9 21.65,17.1 20.55,18.2 18.91,18.2 P1.2
N$34
  Top 0.15: P1.11 4.92,11.27 7.65,14 11.65,14 22.65,3 R39.1
N$35
  Top 0.15: P1.9 4.92,17.83 7.7,15.05 11.3,15.05 21.55,4.8 25,4.8 R38.1
N$36
  Top 0.254: P1.5 16.35,13.9 18.45,11.8 19.55,11.8 20.25,11.1 20.25,6.95 21.95,5.25 23.7,5.25 24.45,6 25.8,6 C26.2
  Top 0.305: R32.1 R33.1 C26.2
N$37  (via drill 0.3)
  Top 0.15: R12.2 v78,35.85
  Bottom 0.15: $$U$3.D0 84.95,50.52 84.95,42.8 v78,35.85 81.15,32.7 88.2,32.7 89.8,31.1 89.8,30 91,28.8 JP3.2
N$39  (via drill 0.3)
  Top 0.406: D2.1 v15,39.35 | v15,44.1 15.45,44.1 16,44.65 D1.1
  Top 0.813: D1.1 16,46.3 S1.1
  Bottom 0.406: v15,39.35 v15,44.1
N$57
  Top 0.15: R3.1 R2.2 30,42.8 29.27,43.53 J2.7
PIO0_1/ISP  (via drill 0.3)
  Top 0.15: S2.4 S2.3 66.8,35.5 R10.1 63.65,36.95 v61.45,36.95 | U3.3 50.98,35.33 51.75,36.1 56.2,36.1 57,36.9 57.75,36.9 v57.8,36.95 57.8,39.7 56.2,41.3 v47.2,41.3 | R3.2 33.65,41.2 34.5,40.35 39.7,40.35 40.75,41.4 v40.85,41.4 | JP2.14 83.65,7.05 83.65,8.2 80.45,11.4 56.05,11.4 55.35,12.1 55.35,22.2 54.95,22.6 54.95,26.55 54.6,26.9 v53.95,26.9
  Bottom 0.15: v61.45,36.95 v57.8,36.95 57.8,36.5 57.5,36.2 57.5,33.2 53.95,29.65 v53.95,26.9 | v40.85,41.4 41.4,41.95 44.6,41.95 45.25,41.3 v47.2,41.3
PIO0_2/SSEL0  (via drill 0.3)
  Top 0.15: U6.32 42.85,13.75 44.6,15.5 v44.95,15.5 | v44.5,18.25 R27.1 | U3.8 47.7,34.46 47.7,35.3 47.5,35.5 46.8,35.5 45.25,33.95 v44.7,33.95 | v41.4,21.95 41.4,31.05 v41.25,31.2 | v51.85,9.7 52.6,8.95 69.05,8.95 JP2.9
  Bottom 0.15: v44.5,18.25 44.5,17.65 44.95,17.2 v44.95,15.5 44.95,9.3 45.55,8.7 48.75,8.7 49.75,9.7 v51.85,9.7 | v44.7,33.95 41,33.95 40.1,33.05 40.1,32.35 v41.25,31.2 | 44.5,18.9 v44.5,18.25 | v41.4,21.95 44.5,18.85 v44.5,18.25
PIO0_3/W5500_RST  (via drill 0.3)
  Top 0.15: U3.9 46.54,33.3 v45.45,33.3 | v41.6,33.3 41.6,33.25 41.75,33.1 41.75,22.4 42,22.15 42,21.6 41.6,21.2 R25.1 40.5,20.3 39.75,19.55 U6.37 39.75,16.1 v39.1,15.45 | JP2.7 64.67,8.25 50.9,8.25 50.55,8.6 v50.05,8.6
  Bottom 0.15: v45.45,33.3 v41.6,33.3 | v39.1,15.45 39.1,13.15 44.25,8 49.05,8 49.65,8.6 v50.05,8.6
PIO0_4/SCL  (via drill 0.3)
  Top 0.15: JP1.1 50.65,45.97 | v44.8,32.6 44.83,32.62 U3.10 | JP1.1 45.25,46 41.4,42.15 41.4,34.45 40.75,33.8 40.75,32.8 v40.6,32.65 | C23.2 R36.1 66.95,18.75 S5.3 S5.4 56.75,19.3 56.75,25.2 56.2,25.75 v56.15,25.75 | JP1.1 50.68,46.12 49.6,47.2 41.2,47.2 40.2,48.2 $$U$3.SCL
  Bottom 0.15: v40.6,32.65 40.7,32.6 v44.8,32.6 45.5,32.6 45.85,32.25 45.85,29.2 47.7,27.35 48.65,27.35 50.25,25.75 v56.15,25.75
PIO0_5/SDA  (via drill 0.3)
  Top 0.15: JP1.2 53.2,45.98 | v45.35,32 45.38,31.98 U3.11 | JP1.2 53.22,45.92 52.2,44.9 44.85,44.9 41.75,41.8 41.75,34.25 41.1,33.6 41.1,32.15 v41.25,32 | C14.2 R28.1 66.95,26.75 S4.3 S4.4 56.75,26.75 v56.5,26.5 | $$U$3.SDA 42.75,50.56 42.75,48.25 43.45,47.55 52.1,47.55 53.22,46.43 JP1.2
  Bottom 0.15: v41.25,32 v45.35,32 45.35,29.2 47.55,27 48.5,27 50.1,25.4 55.45,25.4 55.6,25.25 56.35,25.25 56.7,25.6 56.7,26.3 v56.5,26.5
PIO0_6/SCK0  (via drill 0.3)
  Top 0.15: U6.33 42.6,14.25 46.4,18.05 46.4,21.5 47.35,22.45 v47.35,23.15 | U3.15 45.77,29.38 45.5,29.1 45.5,25.85 v45.8,25.55 | JP1.3 | JP1.3 55.76,45.01 55.3,44.55 45.15,44.55 42.1,41.5 42.1,31.4 43.9,29.6 43.9,26.8 45.15,25.55 v45.8,25.55 | $$U$3.D13 54.93,46 JP1.3 | v47.35,25.2 47.2,25.05 46.35,25.05 45.85,25.55 v45.8,25.55 | $$U$3.SCK 84.94,27.8 78.4,27.8 77.64,28.55 U4.2 v77.65,31.45
  Bottom 0.15: v47.35,23.15 v47.35,25.2 | v77.65,31.45 67.5,41.6 59,41.6 55.76,44.84 JP1.3
PIO0_7/INT_N  (via drill 0.3)
  Top 0.15: U3.16 46.08,28.73 45.85,28.5 45.85,26.25 46.55,25.55 v46.7,25.55 | JP2.8 66.86,8.6 51.55,8.6 v51,9.15 | v40.15,15.75 U6.36 42.25,15.75 43,16.5 R26.1 43.8,22 45.2,22 45.5,22.3 45.5,24.2 45.8,24.5 v46.7,24.5
  Bottom 0.15: v40.15,15.75 39.5,15.1 39.5,13.3 44.45,8.35 48.9,8.35 49.7,9.15 v51,9.15 | v46.7,25.55 v46.7,24.5
PIO0_8/MISO0  (via drill 0.3)
  Top 0.15: U6.34 42.45,14.75 45.9,18.2 45.9,21.6 46.2,21.9 46.2,23.4 46.45,23.65 47.25,23.65 47.8,24.2 v47.85,24.2 | v44.4,27.4 44.4,29.65 42.45,31.6 42.45,41.3 45.35,44.2 57.6,44.2 58.3,44.9 JP1.4 57.47,46 $$U$3.D12 | v47.8,25.9 47.73,25.98 U3.17 | v78.9,27.25 v78.91,27.25 U4.8
  Bottom 0.15: v44.4,27.4 44.4,26.4 44.7,26.1 47.6,26.1 v47.8,25.9 47.85,25.85 v47.85,24.2 | $$U$3.MISO 81.9,30.25 v78.9,27.25 78.6,27.25 78.35,27.5 78.35,31.5 67.9,41.95 61.25,41.95 58.3,44.9 JP1.4
PIO0_9/MOSI0  (via drill 0.3)
  Top 0.15: U6.35 42.3,15.25 45.55,18.5 45.55,21.75 45.85,22.05 45.85,23.65 46.2,24 46.9,24 48.38,25.48 v48.38,26.45 | v48.38,26.45 U3.18 | JP1.5 | JP1.5 60.84,44.59 60.1,43.85 45.55,43.85 42.8,41.1 42.8,31.85 44.9,29.75 v44.9,26.85 | $$U$3.D11 60.01,46 JP1.5 | 48.35,26.43 v48.38,26.45 | $$U$3.MOSI 86.28,29 79.1,29 78.91,29.2 U4.1 v78.9,31.45
  Bottom 0.15: v44.9,26.85 45.3,26.45 v48.38,26.45 | JP1.5 60.84,44.61 63.15,42.3 68.25,42.3 78.9,31.65 v78.9,31.45
PIO0_11/AD0
  Top 0.15: 50.35,27.54 U3.21 50.33,24.57 53.6,21.3 53.6,11.05 55,9.65 73.43,9.65 JP2.11
  Bottom 0.15: S6.1 86.1,17 76.1,7 JP2.11
PIO0_12/AD1
  Top 0.15: 51,27.54 U3.22 50.98,24.48 53.95,21.5 53.95,11.25 55.2,10 75.62,10 JP2.12 | 78.62,7.03 JP2.12 | JP2.12 74.74,3.12 $$U$3.A1
PIO0_13/AD2
  Top 0.15: U3.23 51.65,27.54 51.65,24.35 54.3,21.7 54.3,11.45 55.4,10.35 77.81,10.35 JP2.13 | JP2.13 | JP2.13 77.28,3.12 $$U$3.A2
PIO0_14/AD3  (via drill 0.3)
  Top 0.15: v52.3,26.25 52.3,27.54 U3.24 | v52.3,26.25 52.3,24.2 54.65,21.85 54.65,11.6 55.55,10.7 79.1,10.7 82.2,7.6 82.2,6.4 79.82,4.02 $$U$3.A3 | $$U$3.D4 78.62,46.69 JP1.12 78.6,45.98 78.6,43.05 76.9,41.35 61.5,41.35 59.4,39.25 59.4,29.7 57.95,28.25 57.15,28.25 56.5,27.6 55.6,27.6 55.3,27.9 54.2,27.9 52.55,26.25 v52.3,26.25
PIO0_16/AD5  (via drill 0.3)
  Top 0.15: U3.26 54.42,29.38 v54.45,29.35 55.1,28.7 57.9,28.7 59.05,29.85 59.05,39.4 61.35,41.7 74.55,41.7 76.05,43.2 76.05,45.97 JP1.11 76.08,46.69 $$U$3.D5 | v54.45,26.3 54.45,22.6 55,22.05 55,11.75 55.7,11.05 79.45,11.05 82.65,7.85 82.65,5.5 82.36,5.21 $$U$3.A4
  Bottom 0.15: v54.45,26.3 v54.45,29.35
PIO0_17  (via drill 0.3)
  Top 0.15: v59.9,33.05 59.75,33.2 59.75,39.1 61.65,41 79.2,41 81.15,42.95 JP1.13 81.16,46.69 $$U$3.D3 | v58.15,33.05 56.25,33.05 55.17,31.98 U3.30
  Bottom 0.15: v59.9,33.05 v58.15,33.05
PIO0_18/RXD  (via drill 0.3)
  Top 0.15: JP1.16 88.7,45.92 88.7,43 85.65,39.95 79.5,39.95 79.15,39.6 79.15,36.75 78.8,36.4 78.8,34 R12.1 76.85,34.35 76.85,39.5 76.4,39.95 62.1,39.95 60.8,38.65 60.8,35.05 61.15,34.7 61.15,34.25 60.7,33.8 v60.6,33.8 | v58.15,33.8 56.3,33.8 55.12,32.62 U3.31 | R23.2 39.7,28.6 39.7,26.05 40,25.75 40.75,25.75 v40.9,25.9
  Bottom 0.15: v58.15,33.8 v60.6,33.8 60.6,28.05 56.4,23.85 49.8,23.85 47.9,21.95 46.65,21.95 46.15,22.45 46.15,23.15 43.4,25.9 v40.9,25.9
PIO0_19/TXD  (via drill 0.3)
  Top 0.15: JP1.15 86.25,43 83.55,40.3 79.35,40.3 78.8,39.75 78.8,38 R11.1 77.2,38 77.2,39.65 76.55,40.3 61.95,40.3 60.45,38.8 60.45,34.65 v60.6,34.5 | U3.32 54.92,33.27 56.15,34.5 v58.15,34.5 | R9.2 39.2,33.8 39.4,33.6 39.4,30.9 40.05,30.25 40.05,26.5 v40.3,26.25
  Bottom 0.15: v58.15,34.5 v60.6,34.5 61.1,34 61.1,28 58.85,25.75 58.8,25.75 56.55,23.5 49.95,23.5 48.05,21.6 46.5,21.6 45.8,22.3 45.8,23 43.45,25.35 40.65,25.35 40.3,25.7 v40.3,26.25
PIO0_20
  Top 0.15: U3.7 48.35,34.46 48.35,35.55 48,35.9 46.7,35.9 45.9,35.1 44.65,35.1 44.2,35.55 44.2,39.2 47.4,42.4 70.2,42.4 71,43.2 JP1.9 71,46.69 $$U$3.D7
PIO0_22/AD6
  Top 0.15: 49.7,27.54 U3.20 49.67,24.73 53.25,21.15 53.25,10.85 54.8,9.3 71.24,9.3 JP2.10 | 73.5,7 JP2.10 | JP2.10 72.2,5.66 $$U$3.A0
PIO0_23/AD7  (via drill 0.3)
  Top 0.15: U3.27 54.98,30.02 v55,30 55.95,29.05 57.75,29.05 58.7,30 58.7,39.55 61.2,42.05 72.5,42.05 73.5,43.05 73.5,45.96 JP1.10 73.54,46.69 $$U$3.D6 | $$U$3.A5 84.9,8.45 81.6,11.75 56.25,11.75 55.7,12.3 55.7,22.35 55.3,22.75 55.3,26.7 54.95,27.05 v54.95,27.35
  Bottom 0.15: v54.95,27.35 55,27.4 v55,30
PIO1_15  (via drill 0.3)
  Top 0.15: $$U$3.D2 83.7,46.69 JP1.14 83.7,42.95 81.4,40.65 61.8,40.65 60.1,38.95 60.1,33.6 60.45,33.25 60.45,32.85 59.9,32.3 59.9,29.35 v58.8,28.25 | U3.28 55.12,30.68 v55.75,30.05
  Bottom 0.15: v58.8,28.25 57.55,28.25 v55.75,30.05
PIO1_19/SSEL1  (via drill 0.3)
  Top 0.15: JP1.17 91.25,45.93 91.25,42.55 88.3,39.6 79.8,39.6 79.5,39.3 79.5,36.35 79.15,36 79.15,32.8 78.65,32.3 75.85,32.3 75.11,31.55 U4.4 75.05,30.35 64.05,30.35 61.85,32.55 61.85,35.25 v61.7,35.4 | v58.15,35.4 52.55,35.4 52.27,35.12 U3.1
  Bottom 0.15: v61.7,35.4 v58.15,35.4
PIO1_21/LEDR  (via drill 0.3)
  Top 0.15: U3.12 46.54,31.35 45.2,31.35 43.85,32.7 43.85,39.8 v44.4,40.35 46.8,42.75 67.35,42.75 68.46,43.86 JP1.8 67.63,46 $$U$3.D8 | v37,41.2 R5.1
  Bottom 0.15: v44.4,40.35 44.3,40.35 43.85,40.8 43.85,41.1 43.65,41.3 43.1,41.3 42.2,40.4 37.6,40.4 37,41 v37,41.2
PIO1_23/LEDG  (via drill 0.3)
  Top 0.15: U3.13 46.54,30.7 45.3,30.7 43.5,32.5 43.5,40.2 v44.4,41.1 46.45,43.15 65.15,43.15 65.92,43.92 JP1.7 65.09,46 $$U$3.D9 | v39,41.2 R6.1
  Bottom 0.15: v44.4,41.1 44.4,41.3 44.1,41.6 42.9,41.6 42.05,40.75 39.3,40.75 39,41.05 v39,41.2
PIO1_24/LEDB  (via drill 0.3)
  Top 0.15: U3.14 46.54,30 45.25,30 43.15,32.1 43.15,40.6 v43.35,40.8 46.05,43.5 62.6,43.5 63.38,44.28 JP1.6 62.55,46 $$U$3.D10 | v35,41.2 R4.1
  Bottom 0.15: v43.35,40.8 42.6,40.05 35.7,40.05 35,40.75 v35,41.2
PMODE0
  Top 0.15: U6.45 35.75,18.4 35.65,18.5 33.7,18.5 33.15,17.95 29.4,17.95 29,18.35 27.25,18.35 26.8,18.8 26.8,19.7 R16.2
PMODE1
  Top 0.15: U6.44 36.25,18.4 35.85,18.8 33.5,18.8 33,18.3 29.9,18.3 29.25,18.95 29.25,19.75 R17.2
POMDE2
  Top 0.15: U6.43 36.75,18.45 36.05,19.15 32.35,19.15 R18.2
RXN  (via drill 0.3)
  Top 0.15: U6.5
  Top 0.254: C25.2 24.2,9 R33.2 | U6.5 31.1,13.75 v30.6,13.25
  Bottom 0.254: v30.6,13.25 26.35,9 R33.2
  other vias: 25.2,9
RXP
  Top 0.254: C18.2 23.8,11 R32.2 26.2,12 28.45,12 29.15,12.7 30.95,12.7 31.5,13.25 U6.6
SWCLK/PIO0_10  (via drill 0.3)
  Top 0.15: JP2.16 88.78,7.02 83.35,12.45 56.75,12.45 56.4,12.8 56.4,22.8 56.15,23.05 v56.15,24.75 | J2.4 26.75,49.98 26.75,48.4 27.4,47.75 27.4,44 29.25,42.15 29.25,41 29.8,40.45 33.65,40.45 34.1,40 37.35,40 40.1,37.25 40.1,31.4 41.05,30.45 41.05,27.45 v40.9,27.3 | 49.05,27.54 U3.19 49.02,24.77 v49.05,24.75
  Bottom 0.15: v56.15,24.75 v49.05,24.75 49.05,24.15 47.55,22.65 47.1,22.65 46.85,22.9 46.85,23.45 43,27.3 v40.9,27.3
SWDIO/PIO0_15  (via drill 0.3)
  Top 0.15: JP2.15 86.2,7.04 86.2,8.25 82.35,12.1 56.5,12.1 56.05,12.55 56.05,22.55 55.65,22.95 55.65,26.7 v56,27.05 | U3.25 54.23,28.73 54.7,28.25 55.9,28.25 v56,28.15 | J2.2 25.5,49.96 25.5,48.4 26.1,47.8 26.1,44.35 28.9,41.55 28.9,40.75 29.55,40.1 33.45,40.1 33.9,39.65 37.1,39.65 39.75,37 39.75,31.1 40.7,30.15 40.7,27.8 40.4,27.5 40.4,27.1 v40.9,26.6
  Bottom 0.15: v56,27.05 v56,28.15 | 56.3,27.05 v56,27.05 | v40.9,26.6 43.2,26.6 46.5,23.3 46.5,22.65 46.85,22.3 47.7,22.3 49.65,24.25 56.35,24.25 57.2,25.1 57.2,26.65 56.8,27.05 v56,27.05
TXN  (via drill 0.3)
  Top 0.254: v31.45,16.45 31.45,15.9 31.6,15.75 U6.1 | P1.3 19.59,16.91 21.15,15.35 21.15,14.1 22.25,13 R31.1
  Bottom 0.254: R31.1 25.25,13 28.7,16.45 v31.45,16.45
  other vias: 25.2,13
TXP
  Top 0.254: U6.2 31.1,15.25 30.9,15.45 30.9,16.6 30.55,16.95 28.25,16.95 27.35,17.85 26.05,17.85 R29.1 23.85,17 21.4,19.45 P1.1
VCC/2  (via drill 0.3)
  Top 0.3: C4.2 26.82,32.98 U2.20
  Top 0.406: L1.2 15.1,30.45 C12.1 17.2,30.75 TP1.TP 17.2,33.55 D2.2
  Bottom 0.3: TP1.TP 22.7,33 23.5,33.8 C4.2
  other vias: 26,33.8 17.2,33
VCCIO
  Top 0.3: LED4.1 LED3.1 22.95,31.75 22.95,32.8 23.95,33.8 C2.2 24.9,34.7 27.1,34.7 27.32,34.92 U2.17 28.9,34.95 30.35,34.95 30.77,34.52 30.77,33.62 | U2.4 36.1,29.7 34.7,29.7 30.77,33.62 | 30.77,33.62 U2.19
XI
  Top 0.15: U6.30 44.45,12.75 R35.2 45.75,12.95 47.9,12.95 48.8,12.05 Y2.3 C21.2
XO
  Top 0.15: U6.31 44.45,13.25 R35.1 46.65,13.8 46.95,14.1 Y2.1 C20.2

### Text on the board
Dimension: Unit : mm
tPlace: ON | P0_4 | P0_5 | P0_6 | P0_8 | P0_9 | P1_24 | P1_23 | P1_21 | P0_20 | P0_23 | P0_16 | P0_14 | P0_17 | P0_15 | P0_19 | P0_18 | P1_19 | 10K Jumper | PTM | Temp | +5V | +5V | =3.3V | +3.3V | GND | GND | P0_3 | P0_7 | P0_2 | P0_22 | P0_11 | P0_12 | P0_13 | P0_1 | SWDIO | SWCLK | !RESET! | W5500-EVB V1.0